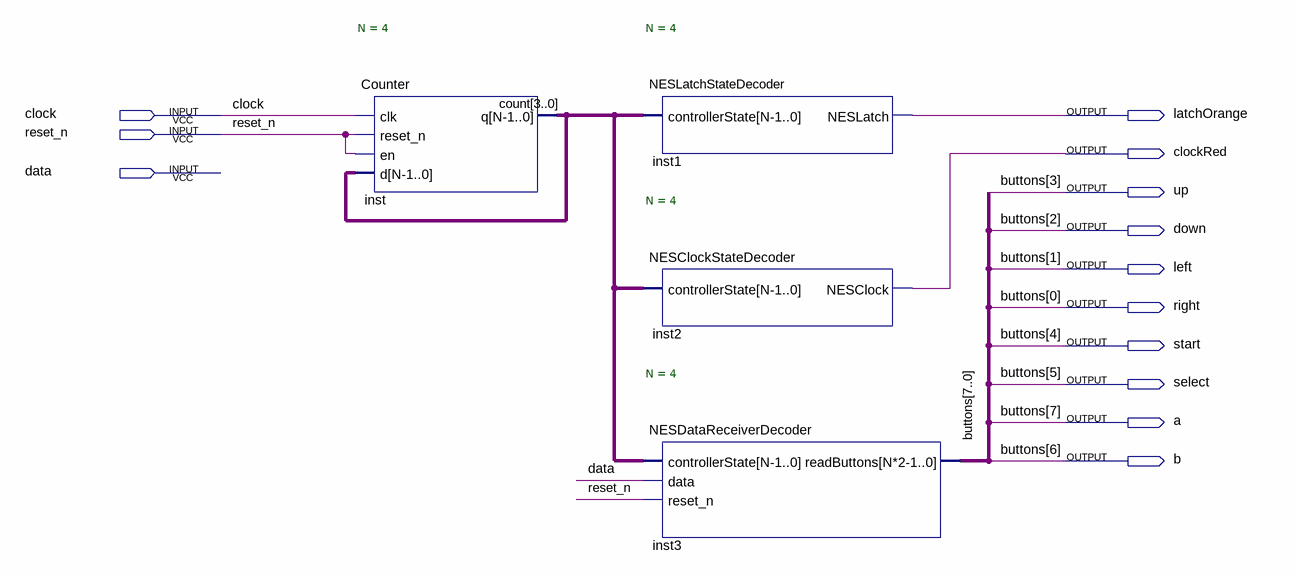
[diagram p0: schematic sheet]
// Quartus schematic NESReader.bdf as structural Verilog: 4 symbols, 13 pins
module NESReader (
  input  clock,
  input  reset_n,
  input  data,
  output latchOrange,
  output clockRed,
  output up,
  output down,
  output left,
  output right,
  output start,
  output select,
  output a,
  output b
);

  wire [3:0] count;

  Counter #(.N(4)) inst (.clk(clock), .reset_n(reset_n), .en(reset_n), .d(count), .q(count));
  NESLatchStateDecoder #(.N(4)) inst1 (.controllerState(count), .NESLatch(latchOrange));
  NESClockStateDecoder #(.N(4)) inst2 (.controllerState(count), .NESClock(clockRed));
  NESDataReceiverDecoder #(.N(4)) inst3 (
    .controllerState(count), .data(data), .reset_n(reset_n),
    .readButtons({a, b, select, start, up, down, left, right}));

  // Other names for the same wires on the sheet: buttons[7:0] = {a, b, select, start, up, down, left, right}
endmodule
